# Altium schematic sheet supply.SchDoc
size 420 x 297 mm; Address1: Address1; Address2: Address2; Address3: Address3; Address4: Address4; DocumentNumber: АБВГ.123456.001 Э3; SheetNumber: 4; SheetTotal: 4; Scale: 1:1; DocumentType: Схема электрическая принципиальная; FirstReferrence: АБВГ.123456.001
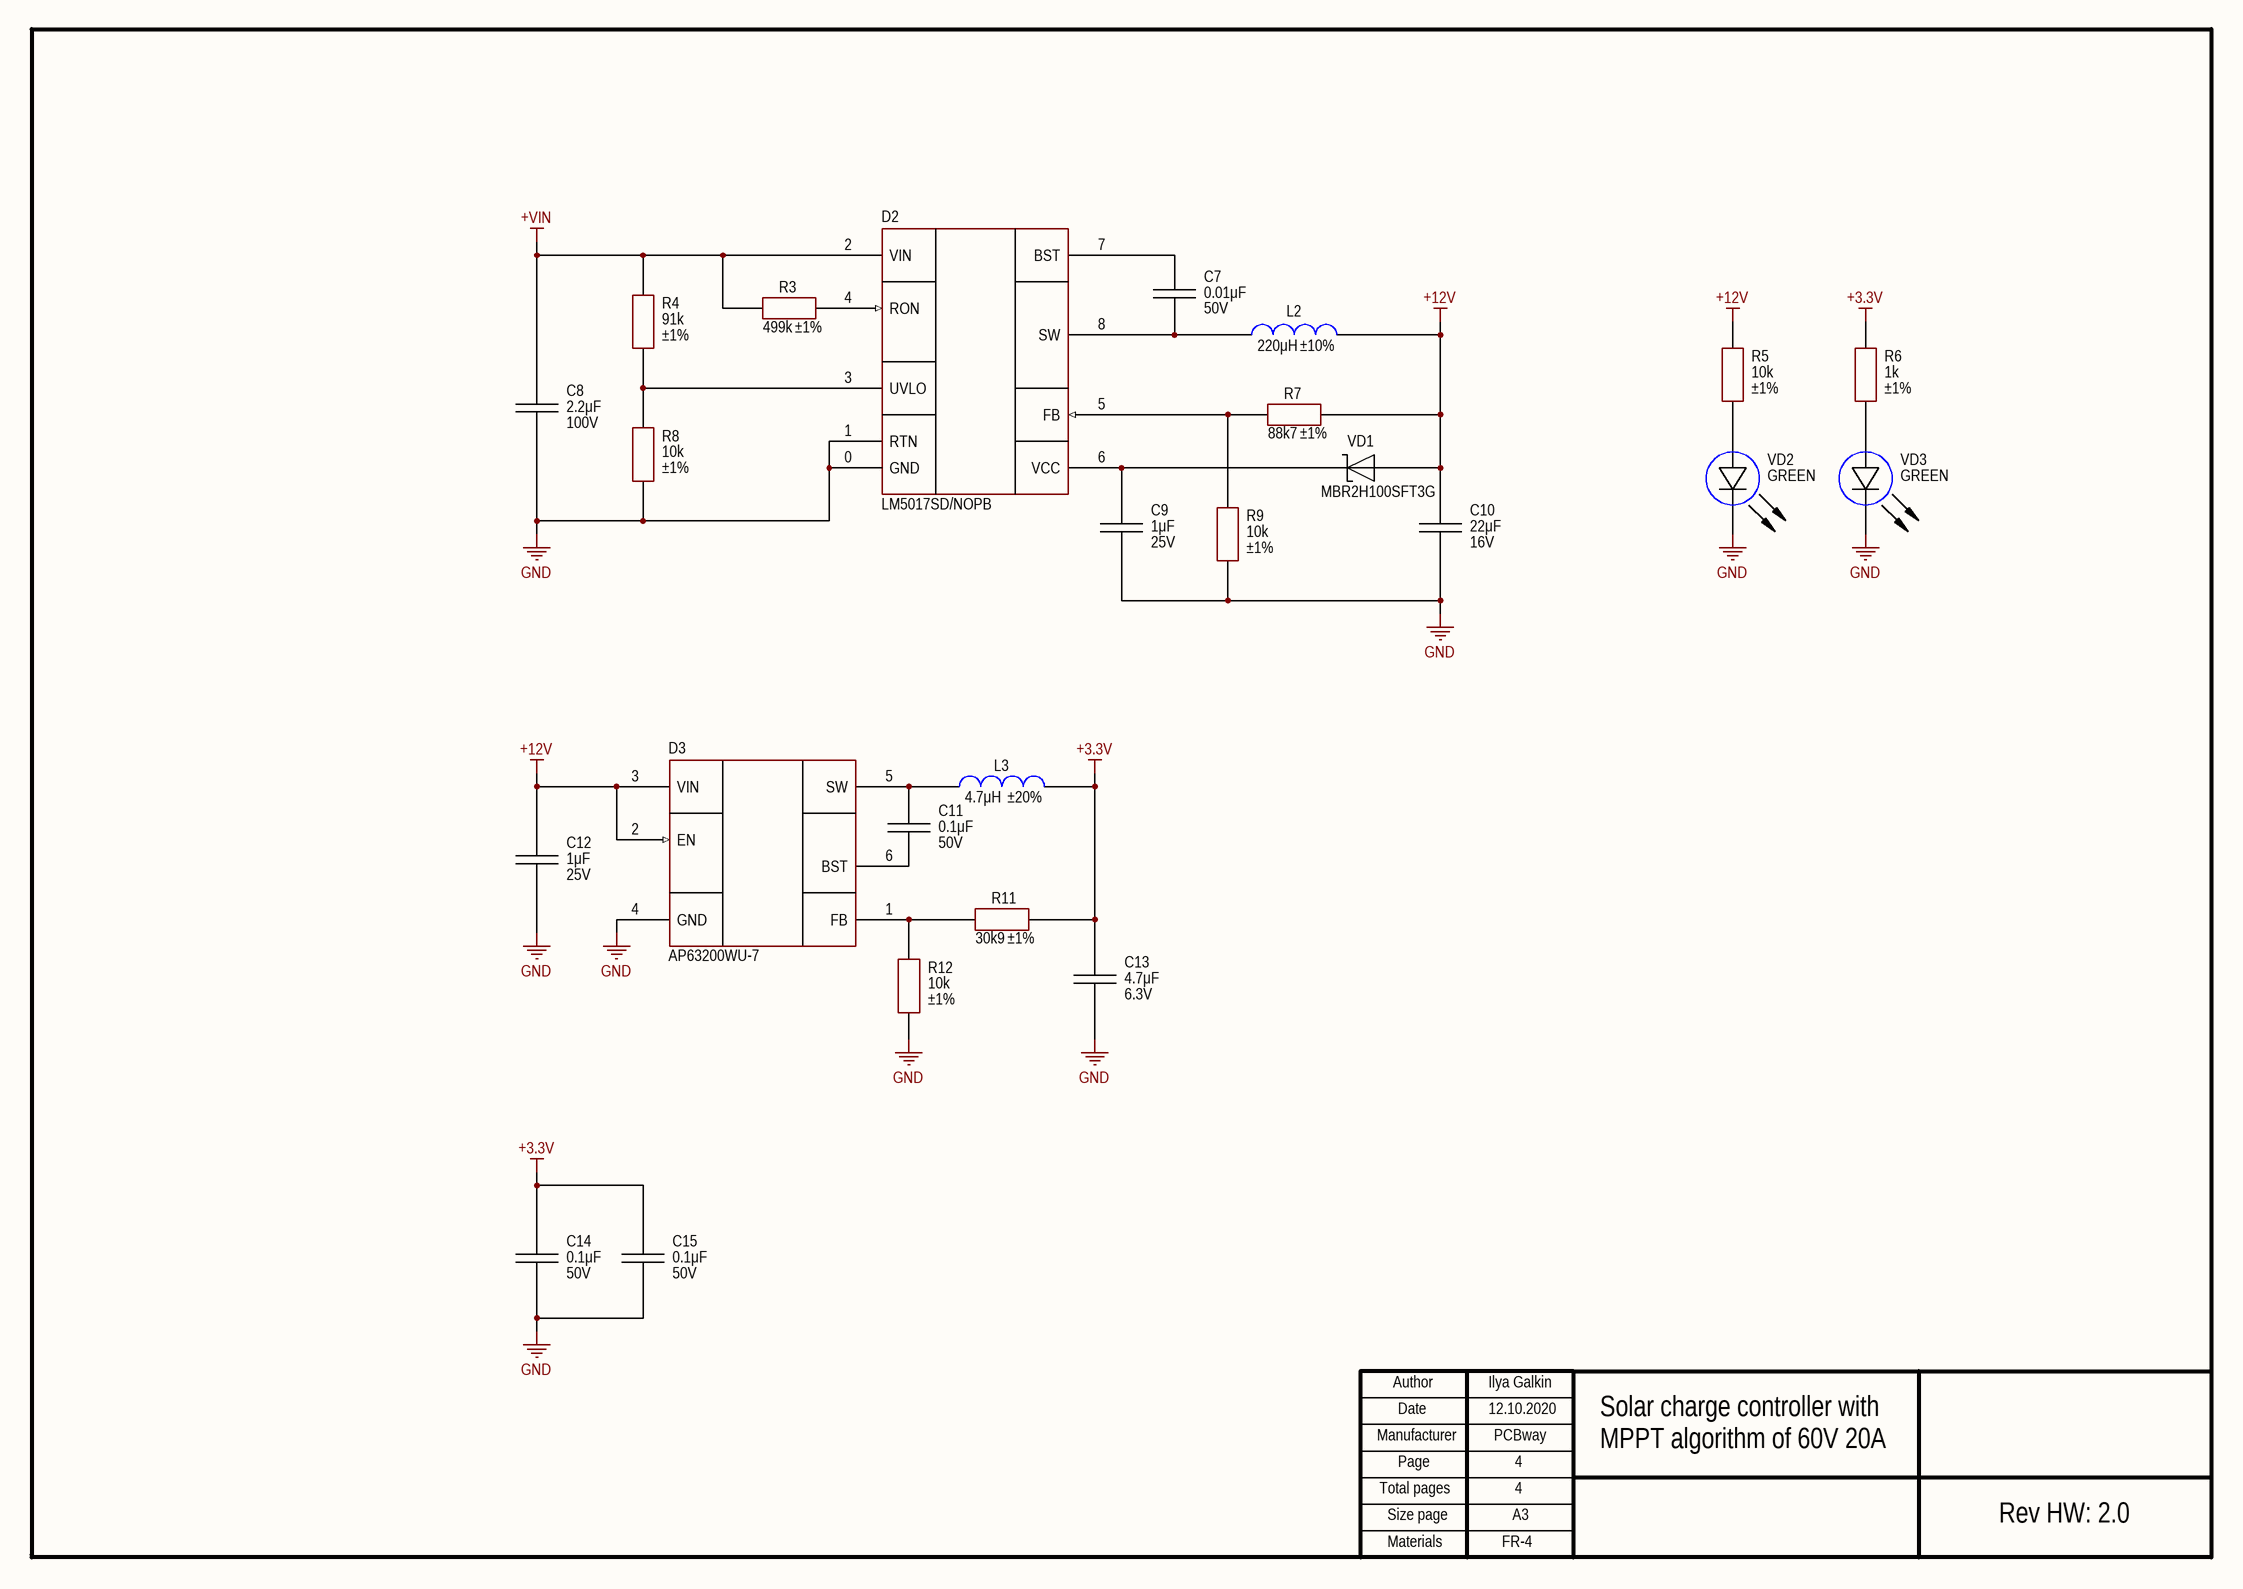
[diagram p0: supply.SchDoc]

## Parts
C7  value 0.01μF  Voltage: 50V  [CAP: 0603]
C8  value 2.2μF  Voltage: 100V  [CAP: 1210]
C9  value 1μF  Voltage: 25V  [CAP: 0603]
C10  value 22μF  Voltage: 16V  [CAP: 1210]
C11  value 0.1μF  Voltage: 50V  [CAP: 0603]
C12  value 1μF  Voltage: 25V  [CAP: 0603]
C13  value 4.7μF  Voltage: 6.3V  [CAP: 0603]
C14  value 0.1μF  Voltage: 50V  [CAP: 0603]
C15  value 0.1μF  Voltage: 50V  [CAP: 0603]
D2  PartNumber: LM5017SD/NOPB  [8-WSON (4x4)]
D3  (no value)  [SOT23-6]
L2  value 220μH  Tolerance: ±10%  [IND: SDR0805]
L3  value 4.7μH  Tolerance: ±20%  [IND: CD32]
R3  value 499k  Tolerance: ±1%  [RES: 0603]
R4  value 91k  Tolerance: ±1%  [RES: 0603]
R5  value 10k  Tolerance: ±1%  [RES: 0603]
R6  value 1k  Tolerance: ±1%  [RES: 0603]
R7  value 88k7  Tolerance: ±1%  [RES: 0603]
R8  value 10k  Tolerance: ±1%  [RES: 0603]
R9  value 10k  Tolerance: ±1%  [RES: 0603]
R11  value 30k9  Tolerance: ±1%  [RES: 0603]
R12  value 10k  Tolerance: ±1%  [RES: 0603]
VD1  PartNumber: MBR2H100SFT3G  [DIODE: SOD123F]
VD2  Color: GREEN  [LED: 0603G]
VD3  Color: GREEN  [LED: 0603G]

## Nets
+3.3V: C13.2 C14.2 C15.2 L3.1 R6.2 R11.1
+12V: C10.2 C12.2 D3.2(EN) D3.3(VIN) L2.1 R5.2 R7.1 VD1.1
+VIN: C8.2 D2.2(VIN) R3.2 R4.2
GND: C8.1 C9.1 C10.1 C12.1 C13.1 C14.1 C15.1 D2.0(GND) D2.1(RTN) D3.4(GND) R8.1 R9.1 R12.1 VD2.2(C) VD3.2(C)
NetC7_1: C7.1 D2.8(SW) L2.2
NetC7_2: C7.2 D2.7(BST)
NetC9_2: C9.2 D2.6(VCC) VD1.2
NetC11_1: C11.1 D3.6(BST)
NetC11_2: C11.2 D3.5(SW) L3.2
NetD2_3: D2.3(UVLO) R4.1 R8.2
NetD2_4: D2.4(RON) R3.1
NetD2_5: D2.5(FB) R7.2 R9.2
NetD3_1: D3.1(FB) R11.2 R12.2
NetR5_1: R5.1 VD2.1(A)
NetR6_1: R6.1 VD3.1(A)

## Notes on the sheet
- Ilya Galkin
- 12.10.2020
- PCBway
- 4
- Solar charge controller with
- MPPT algorithm of 60V 20A
- Rev HW: 2.0
- FR-4
- Author
- Manufacturer
- Date
- Page
- Total pages
- Size page
- A3
- Materials

## Library data of the parts
C7 = Ceramic_0603: Manufacturer: Samsung; PartNumber: CL10B103KB8NNNC; ValueManufacturerPartNumber: Ceramic capacitor, 0.01μF, X7R, ±10%, 50V, 0603, -55...+125°C; TypeCapacitor: Ceramic capacitor; Tolerance: ±10%; TypeDielectric: X7R; Package: 0603; HelpURL: https://www.digikey.com/product-detail/en/samsung-electro-mechanics/CL10B103KB8NNNC/1276-1009-1-ND/3889095; Temperature: -55...+125°C
C8 = Ceramic_1210: Manufacturer: Samsung; PartNumber: CL32B225KCJSNNE; ValueManufacturerPartNumber: Ceramic capacitor, 2.2μF, X7R, ±10%, 100V, 1210, -55...+125°C; TypeCapacitor: Ceramic capacitor; Tolerance: ±10%; TypeDielectric: X7R; Package: 1210; HelpURL: https://www.digikey.com/en/products/detail/samsung-electro-mechanics/CL32B225KCJSNNE/3889020; Temperature: -55...+125°C
C9 C12 = Ceramic_0603: Manufacturer: Samsung; PartNumber: CL10B105KA8NNNC; ValueManufacturerPartNumber: Ceramic capacitor, 1μF, X7R, ±10%, 25V, 0603, -55...+125°C; TypeCapacitor: Ceramic capacitor; Tolerance: ±10%; TypeDielectric: X7R; Package: 0603; HelpURL: https://www.digikey.com/product-detail/en/samsung-electro-mechanics/CL10B105KA8NNNC/1276-1184-1-ND/3889270; Temperature: -55...+125°C
C10 = Ceramic_1210: Manufacturer: Samsung; PartNumber: CL32B226KOJNNNE; ValueManufacturerPartNumber: Ceramic capacitor, 22μF, X7R, ±10%, 16V, 1210, -55...+125°C; TypeCapacitor: Ceramic capacitor; Tolerance: ±10%; TypeDielectric: X7R; Package: 1210; HelpURL: https://www.digikey.com/en/products/detail/samsung-electro-mechanics/CL32B226KOJNNNE/3887513; Temperature: -55...+125°C
C11 C14 C15 = Ceramic_0603: Manufacturer: Samsung; PartNumber: CL10B104KB8WPND; ValueManufacturerPartNumber: Ceramic capacitor, 0.1μF, X7R, ±10%, 50V, 0603, -55...+125°C; TypeCapacitor: Ceramic capacitor; Tolerance: ±10%; TypeDielectric: X7R; Package: 0603; HelpURL: https://www.digikey.com/product-detail/en/samsung-electro-mechanics/CL10B104KB8WPND/1276-CL10B104KB8WPNDCT-ND/11488014; Temperature: -55...+125°C
C13 = Ceramic_0603: Manufacturer: Samsung; PartNumber: CL10B475KQ8NQNC; ValueManufacturerPartNumber: Ceramic capacitor, 4.7μF, X7R, ±10%, 6.3V, 0603, -55...+125°C; TypeCapacitor: Ceramic capacitor; Tolerance: ±10%; TypeDielectric: X7R; Package: 0603; HelpURL: https://www.digikey.com/en/products/detail/samsung-electro-mechanics/CL10B475KQ8NQNC/3887745; Temperature: -55...+125°C
D2 = LM5017SD: Buck converter; Manufacturer: Texas Instruments; ValueManufacturerPartNumber: DC/DC buck converter, input 7.5...100V, 1MHz, output 1.225...90V, 0.6A, -40...+125°C, 8-WSON; VoltageInput: input 7.5...100V; Frequency: 1MHz; CurrentOutput: 0.6A; VoltageOutput: output 1.225...90V; HelpURL: https://www.digikey.com/product-detail/en/texas-instruments/LM5017SD-NOPB/LM5017SD-NOPBCT-ND/3137455; Package: 8-WSON; ComponentType: DC/DC buck converter; Temperature: -40...+125°C
D3 = AP63200WU-7: Buck converter; Manufacturer: Diodes; ValueManufacturerPartNumber: DC/DC buck converter, input 3.8...32V, 500kHz, output 1.2...12V, 2A, -40...+85°C, SOT23-6; VoltageInput: input 3.8...32V; Frequency: 500kHz; CurrentOutput: 2A; VoltageOutput: output 1.2...12V; HelpURL: https://www.digikey.com/en/products/detail/diodes-incorporated/AP63200WU-7/9858423; Package: SOT23-6; ComponentType: DC/DC buck converter; Temperature: -40...+85°C; PartNumber: AP63200WU-7
L2 = Inductor_SDR0805: Manufacturer: Bourns; PartNumber: SDR0805-221KL; ValueManufacturerPartNumber: Fixed inductor, 220μH, ±10%, SDR0805, 490mA, -40...+125°C; TypeInductor: Fixed inductor; MaxCurrent: 490mA; Package: SDR0805; HelpURL: https://www.digikey.com/product-detail/en/bourns-inc/SDR0805-221KL/SDR0805-221KLCT-ND/2127164; Temperature: -40...+125°C
L3 = Inductor_CD32: Manufacturer: YJYCOIN; PartNumber: CD32YP0302-4R7M; ValueManufacturerPartNumber: Fixed inductor, 4.7μH, ±20%, CD32 series, 1.5A, -40...+125°C; TypeInductor: Fixed inductor; MaxCurrent: 1.5A; Package: CD32 series; HelpURL: https://lcsc.com/product-detail/New-Arrivals_YJYCOIN-CD32YP0302-4R7M_C492259.html; Temperature: -40...+125°C
R3 = Resistor_0603: Manufacturer: Yageo; PartNumber: RC0603FR-07499KL; ValueManufacturerPartNumber: Resistor film, 499k, ±1%, 0603, 0.1W, -55...+125°C; TypeResistor: Resistor film; Power: 0.1W; Package: 0603; HelpURL: https://www.digikey.com/en/products/detail/yageo/RC0603FR-07499KL/727267?s=N4IgTCBcDaIEoGEAMA2JBmAYnAtEg7ACwCcxA0gDIgC6AvkA; Temperature: -55...+125°C
R4 = Resistor_0603: Manufacturer: Yageo; PartNumber: RC0603FR-0791KL; ValueManufacturerPartNumber: Resistor film, 91k, ±1%, 0603, 0.1W, -55...+125°C; TypeResistor: Resistor film; Power: 0.1W; Package: 0603; HelpURL: https://www.digikey.com/en/products/detail/yageo/RC0603FR-0791KL/727428?s=N4IgTCBcDaIEoGEAMA2JBmAYnAtEg7AJwCMA0gDIgC6AvkA; Temperature: -55...+125°C
R5 R8 R9 R12 = Resistor_0603: Manufacturer: Yageo; PartNumber: AC0603FR-0710KL; ValueManufacturerPartNumber: Resistor film, 10k, ±1%, 0603, 0.1W, -55...+125°C; TypeResistor: Resistor film; Power: 0.1W; Package: 0603; HelpURL: https://www.digikey.com/en/products/detail/yageo/AC0603FR-0710KL/2827814; Temperature: -55...+125°C
R6 = Resistor_0603: Manufacturer: Yageo; PartNumber: RC0603FR-071KL; ValueManufacturerPartNumber: Resistor film, 1k, ±1%, 0603, 0.1W, -55...+125°C; TypeResistor: Resistor film; Power: 0.1W; Package: 0603; HelpURL: https://www.digikey.com/product-detail/en/yageo/RC0603FR-071KL/311-1-00KHRCT-ND/729790; Temperature: -55...+125°C
R7 = Resistor_0603: Manufacturer: Yageo; PartNumber: RC0603FR-0788K7L; ValueManufacturerPartNumber: Resistor film, 88k7, ±1%, 0603, 0.1W, -55...+125°C; TypeResistor: Resistor film; Power: 0.1W; Package: 0603; HelpURL: https://www.digikey.com/en/products/detail/yageo/RC0603FR-0788K7L/727415?s=N4IgTCBcDaIEoGEAMA2JBmAYnAtEg7AByEDS%2BAMiALoC%2BQA; Temperature: -55...+125°C
R11 = Resistor_0603: Manufacturer: Yageo; PartNumber: RC0603FR-0730K9L; ValueManufacturerPartNumber: Resistor film, 30k9, ±1%, 0603, 0.1W, -55...+125°C; TypeResistor: Resistor film; Power: 0.1W; Package: 0603; HelpURL: https://www.digikey.com/en/products/detail/yageo/RC0603FR-0730K9L/727144; Temperature: -55...+125°C
VD1 = Schottky_single: Manufacturer: ON Semiconductor; ValueManufacturerPartNumber: Schottky diode, 100V, 2A, 840mV, 15pF, SOD-123F, -55...+150°C; TypeDiode: Schottky diode; Voltage: 100V; Current: 2A; VoltageDrop: 840mV; RecoveryTime: 15pF; Package: SOD-123F; HelpURL: https://www.digikey.com/product-detail/en/on-semiconductor/MBR2H100SFT3G/MBR2H100SFT3GOSCT-ND/3462288; Temperature: -55...+150°C
VD2 VD3 = LED_single: Manufacturer: Wurth; ValueManufacturerPartNumber: LED, 20mA, 2V, 0603, -55...+150°C; PartNumber: 150060VS75000; TypeDiode: LED; Current: 20mA; VoltageDrop: 2V; Package: 0603; HelpURL: https://www.digikey.com/product-detail/en/w-rth-elektronik/150060VS75000/732-4980-1-ND/4489904; Temperature: -55...+150°C